# EAGLE design 555 Astable (EAGLE 6.5.0)
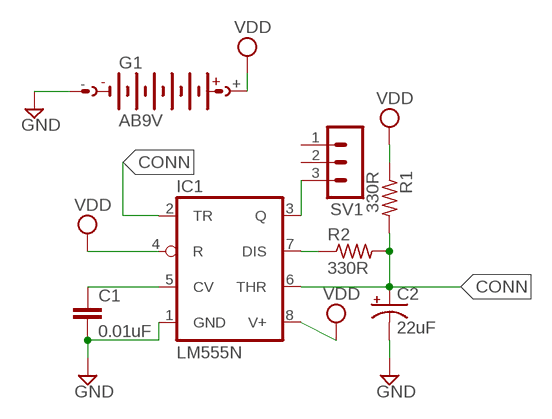
[diagram p0: schematic, sheet 1]

## Parts
C1  0.01uF  C5/2.5  [C5B2.5]
C2  22uF  CPOL-USE3.5-8  [E3,5-8]
G1  AB9V  [AB9V]
IC1  LM555N  [DIL08]
R1  330R  R-US_0207/10  [0207/10]
R2  330R  R-US_0207/10  [0207/10]
SV1  MA03-1  [MA03-1]

## Nets
CONN: C2.+ IC1.2(TR) IC1.6(THR) R1.2 R2.2
GND: C1.2 C2.- G1.- IC1.1(GND)
N$1: C1.1 IC1.5(CV)
N$2: IC1.3(Q) SV1.3
N$4: IC1.7(DIS) R2.1
VDD: G1.+ IC1.4(R) IC1.8(V+) R1.1
Unconnected: SV1.1 SV1.2

## Library data of the parts
C1 = capacitor-wima:C: CAPACITOR naming: grid - package width
C2 = rcl:CPOL-US: POLARIZED CAPACITOR, American symbol
G1 = battery:AB9V: 9-V BATTERY CLIP
IC1 = linear:*555: TIMER
R1 R2 = resistor:R-US_: RESISTOR, American symbol
SV1 = con-lstb:MA03-1: PIN HEADER; OC_FARNELL: unknown; OC_NEWARK: unknown

## Board
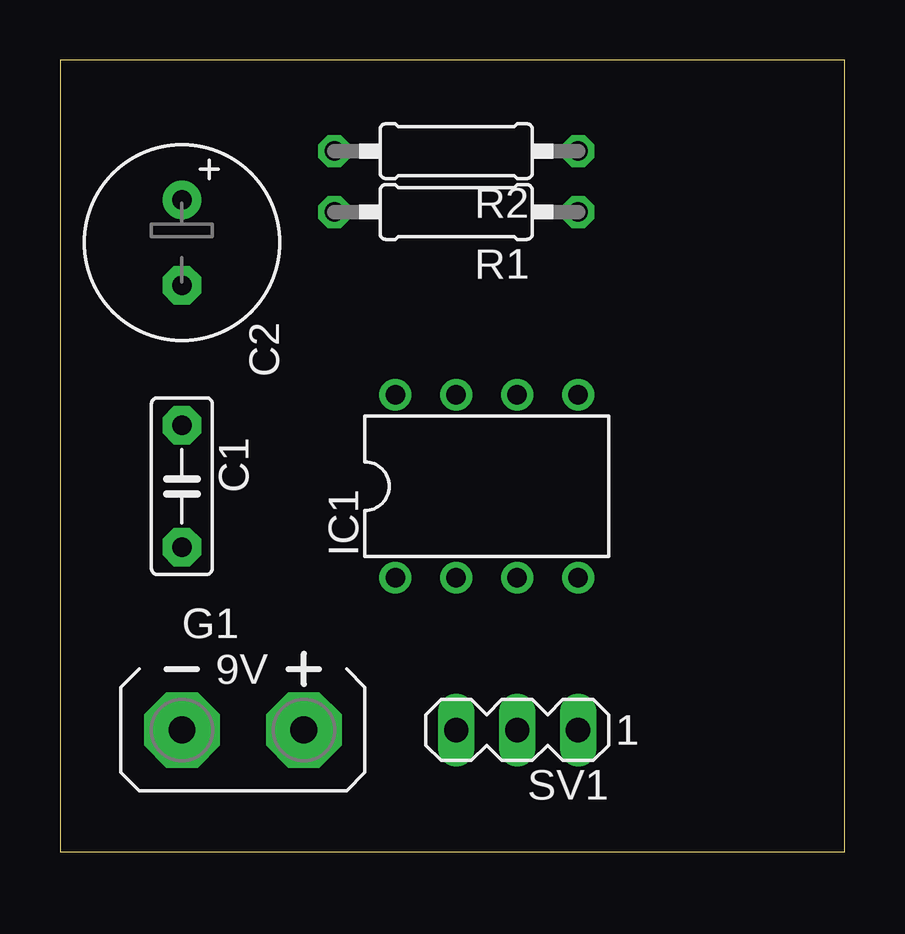
[diagram p1: board, top side]
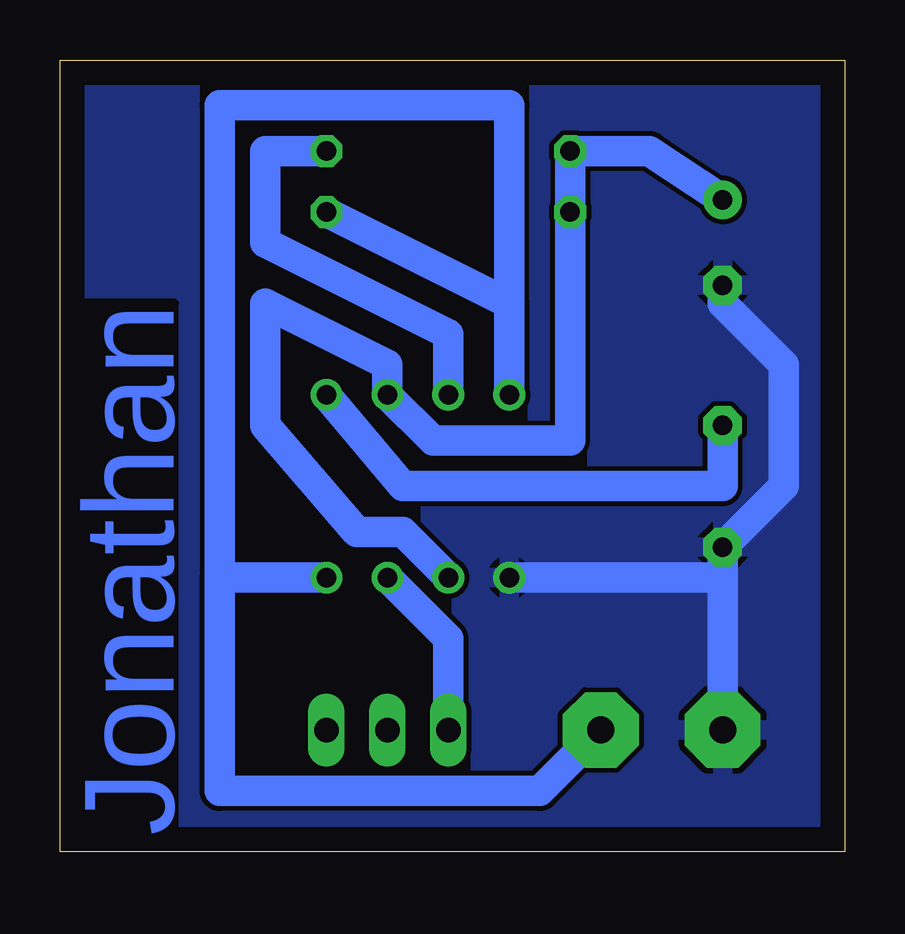
[diagram p2: board, bottom side, seen from below]

Size 32.69 x 33.01 mm. Coordinates in mm from the lower left corner, seen from the top.
Outline: 0,0 32.69,0 32.69,33.01 0,33.01 0,0
Copper layers (1*16): Top 0.035mm / dielectric 1.5mm / Bottom 0.035mm
Design rules "default": minimum track width 10mil, minimum drill 24mil, track to track 8mil, track to pad 8mil, pad to pad 8mil, via to via 8mil, smd to smd 8mil, copper to edge 40mil, drill to drill 8mil, minimum pad ring 10mil, minimum via ring 8mil, stop-mask expansion 4mil, vias tented up to drill 0mil, thermal gap 10mil

### Footprints (pad centres in the part's own frame; a part is rotated, then mirrored left to right if it is on the bottom)
C5B2.5 = drill 0.813 pad 1.6 octagon: 1 -2.54,0; 2 2.54,0
E3,5-8 = drill 0.813 pad 1.6: + -1.778,0 | drill 0.813 pad 1.6 octagon: - 1.778,0
AB9V = drill 1.118 pad 3.15 octagon: + 0,2.54; - 0,-2.54
DIL08 = drill 0.813 pad 1.27: 1 -3.81,-3.81; 2 -1.27,-3.81; 3 1.27,-3.81; 4 3.81,-3.81; 5 3.81,3.81; 6 1.27,3.81; 7 -1.27,3.81; 8 -3.81,3.81
0207/10 = drill 0.813 octagon: 1 -5.08,0; 2 5.08,0
MA03-1 = drill 1.016 long: 1 -2.54,0; 2 0,0; 3 2.54,0

### Placement (x,y rotation side)
C1  5.08,15.24 270 top
C2  5.08,25.4 270 top
G1  7.62,5.08 270 top
IC1  17.78,15.24 0 top
R1  16.51,26.67 180 top
R2  16.51,29.21 180 top
SV1  19.05,5.08 180 top

### Tracks (layer width: path | path; a pad name or v marks a point on that pad's centre or on a via)
CONN
  Bottom 1.27: C2.+ 8.13,29.21 R2.2 R1.2 11.43,17.14 17.14,17.14 IC1.6 19.05,20.32 24.13,22.86 24.13,17.78 20.32,13.34 18.41,13.34 IC1.2
GND
  Bottom 1.27: 5.08,11.43 C1.2 2.54,15.24 2.54,20.32 5.08,22.86 C2.- | 5.08,11.43 G1.- | IC1.1 5.08,11.43
  pour Bottom: -1.27,34.29 31.75,34.29 31.75,-1.27 -1.27,-1.27
N$1
  Bottom 1.27: IC1.5 18.41,15.24 5.08,15.24 C1.1
N$2
  Bottom 1.27: IC1.3 16.51,8.89 SV1.3
N$4
  Bottom 1.27: R2.1 24.13,29.21 24.13,25.4 16.51,21.59 IC1.7
VDD
  Bottom 1.27: G1.+ 12.7,2.54 26.04,2.54 26.04,11.43 | 26.04,11.43 IC1.4 | R1.1 13.97,22.86 IC1.8 13.97,31.11 26.04,31.11 26.04,11.43

### Text on the board
Bottom: Jonathan